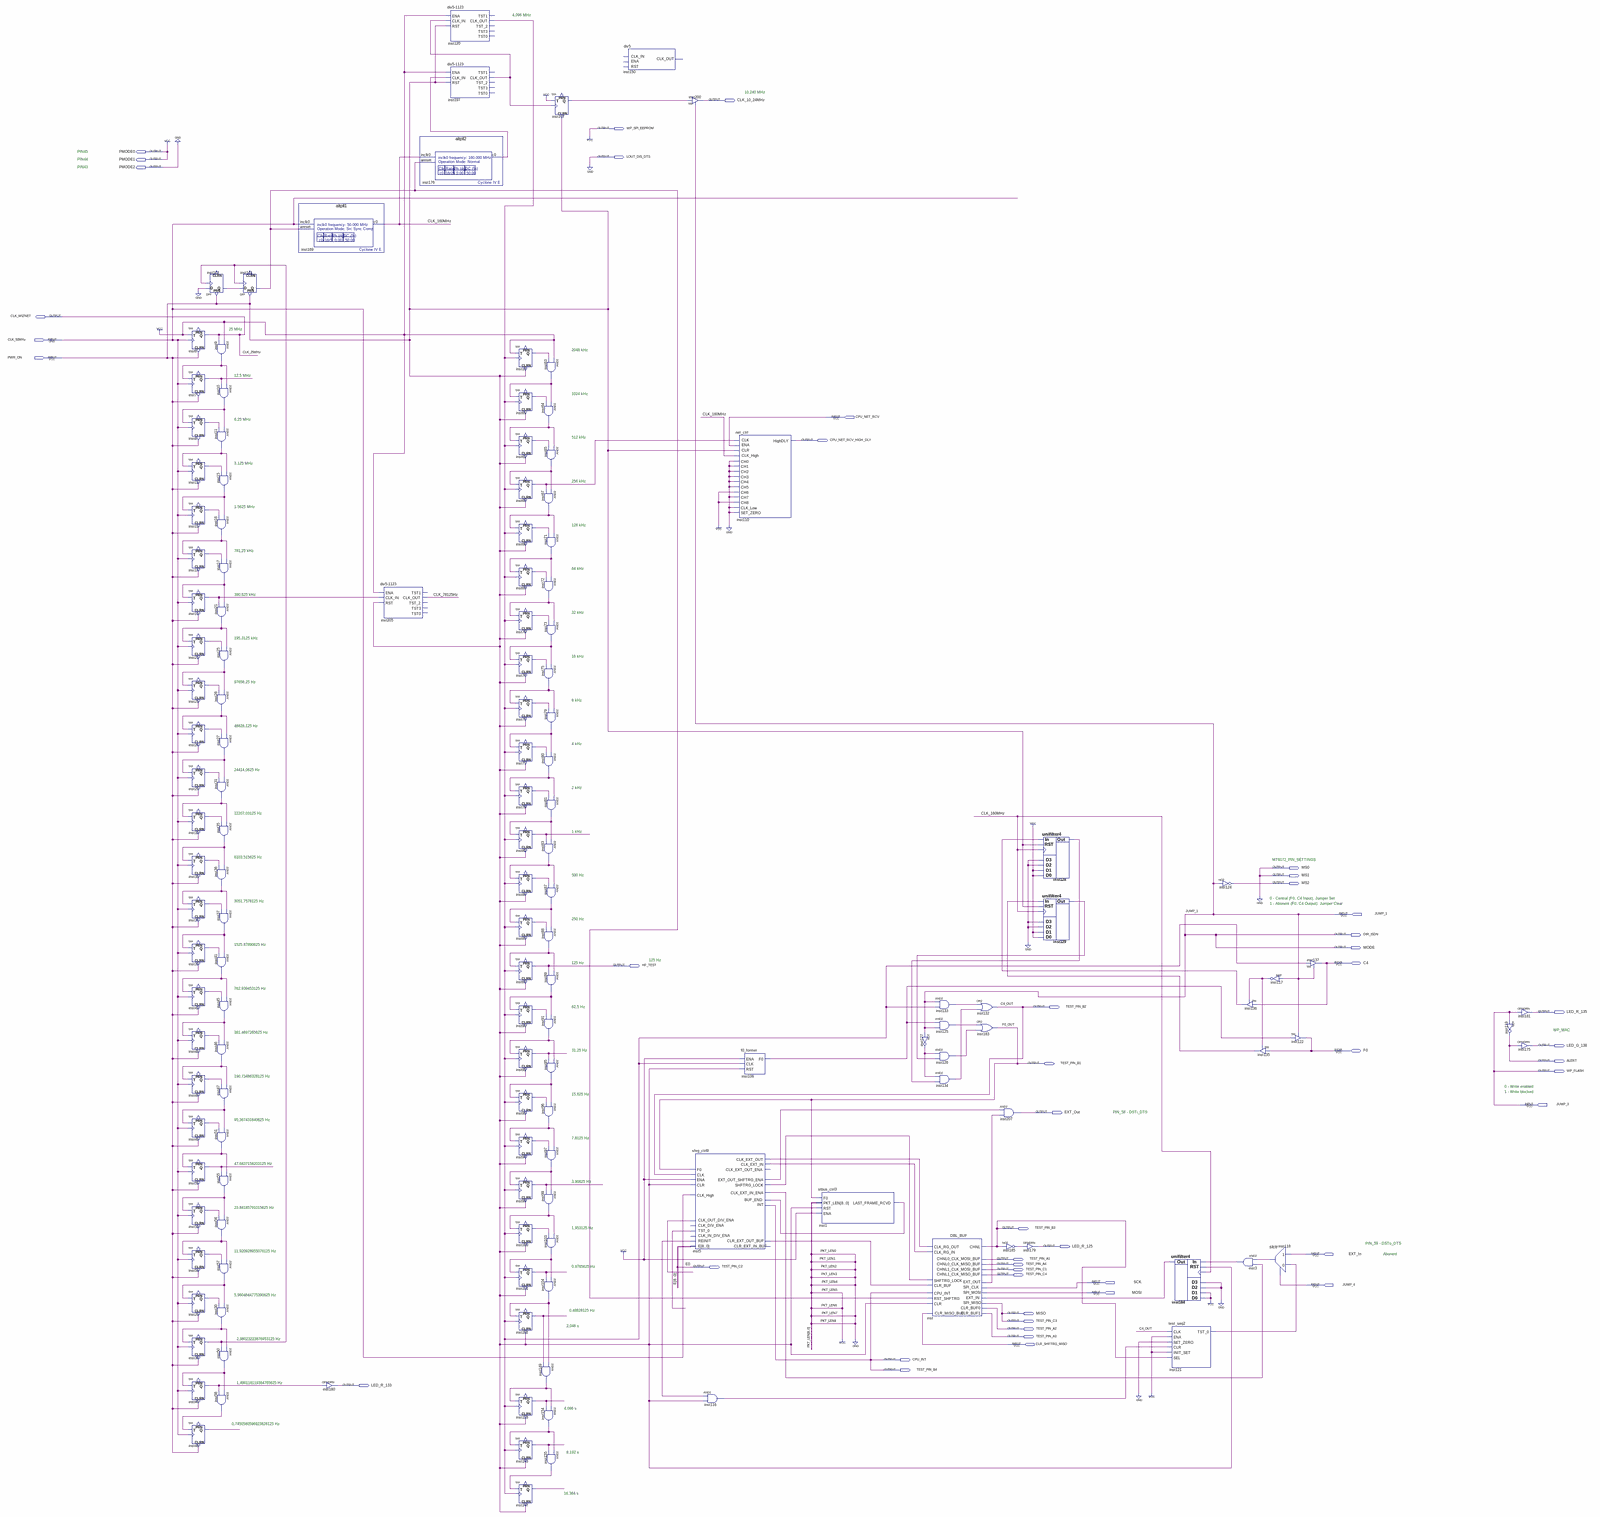
[diagram p0: schematic sheet, whole]
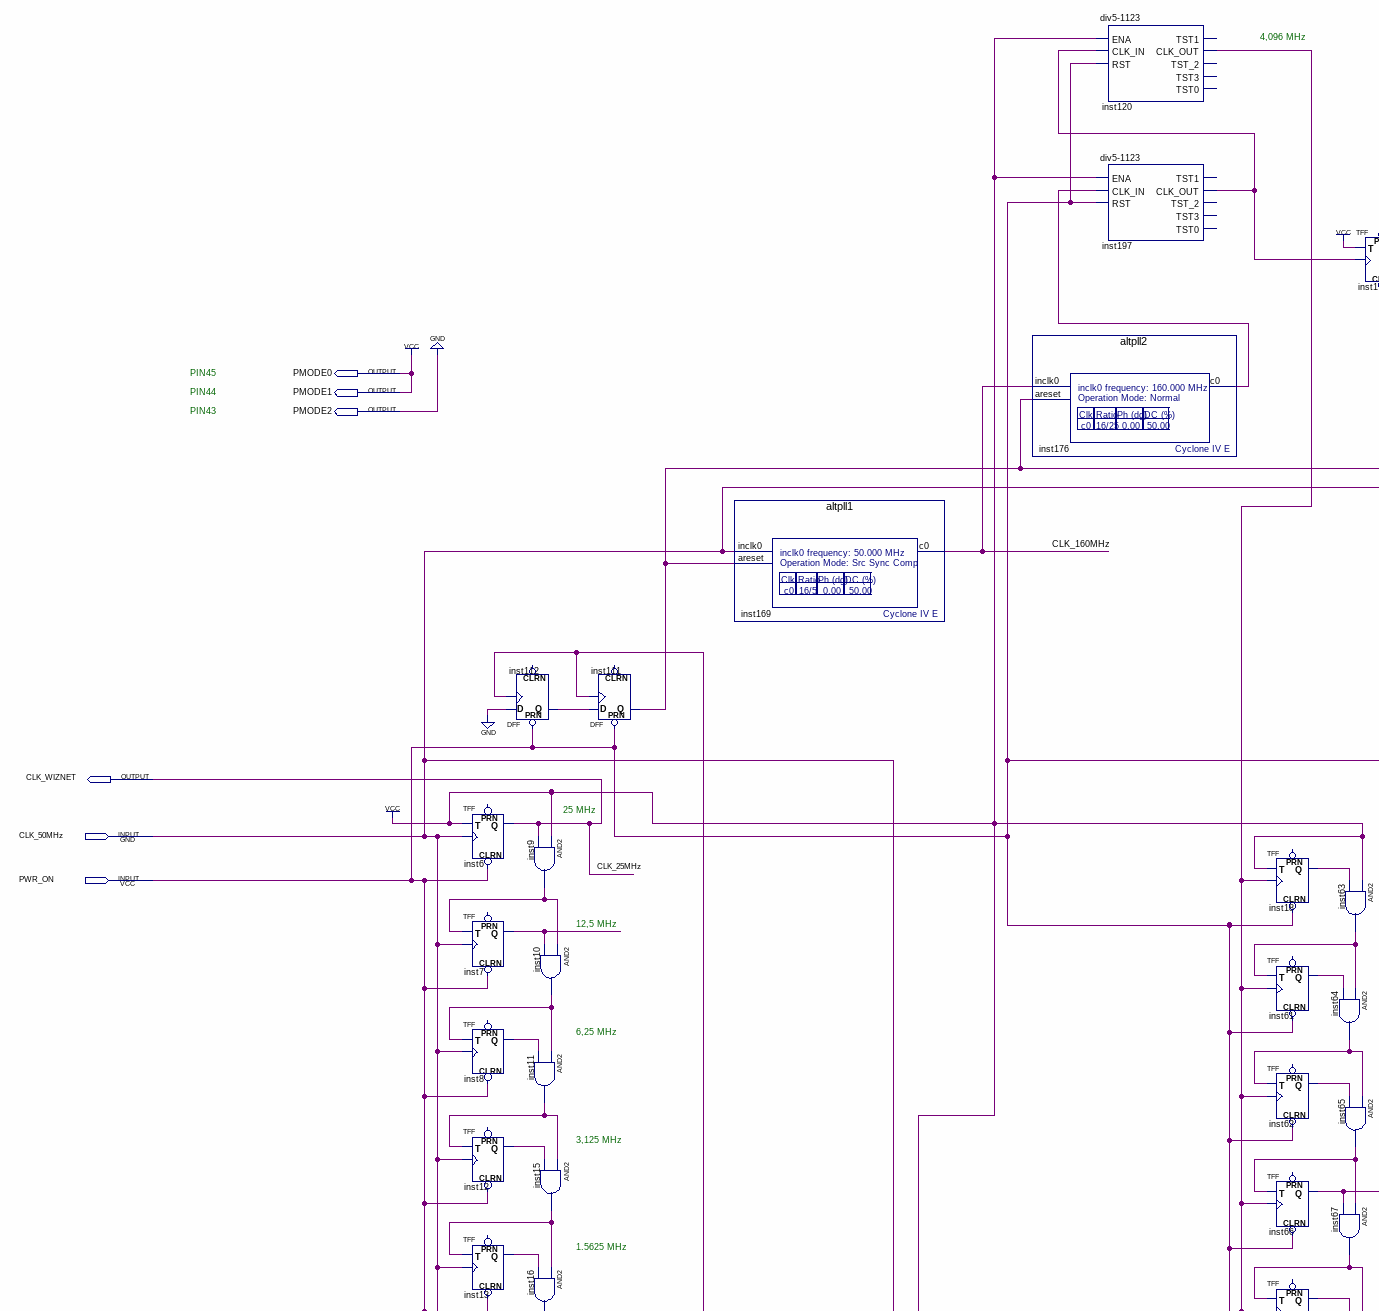
[diagram p1: schematic sheet, upper left part]
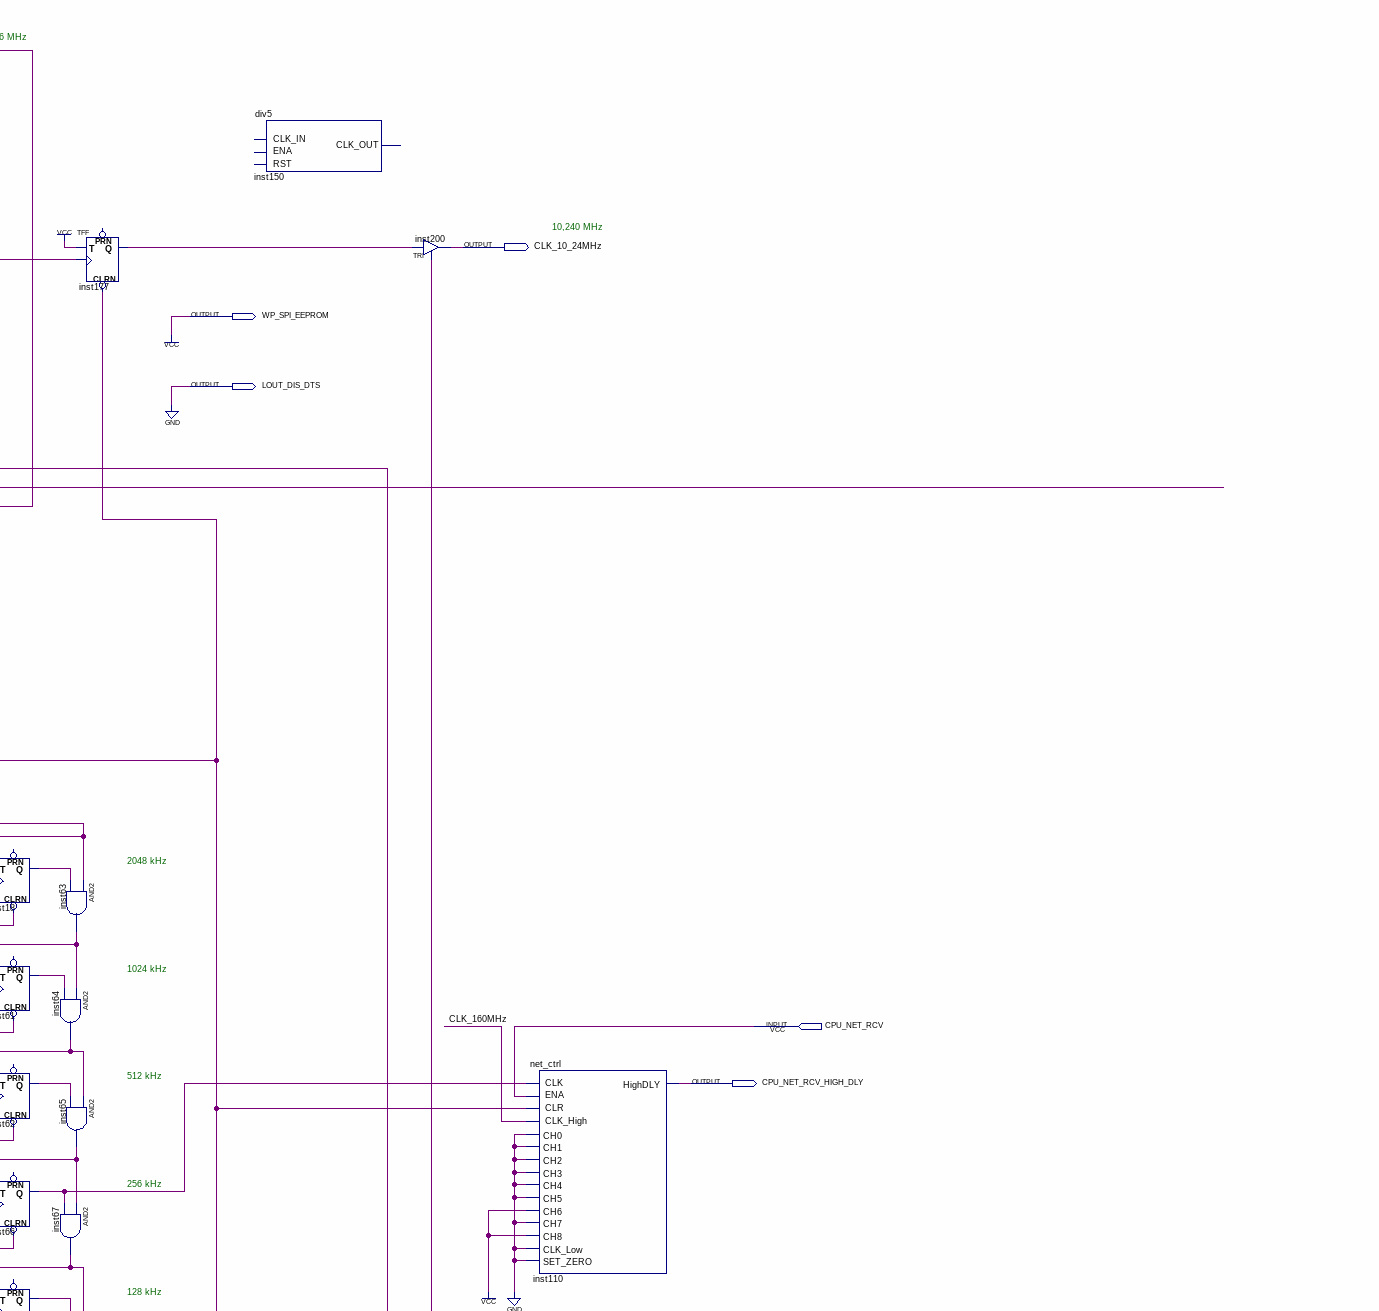
[diagram p2: schematic sheet, upper centre part]
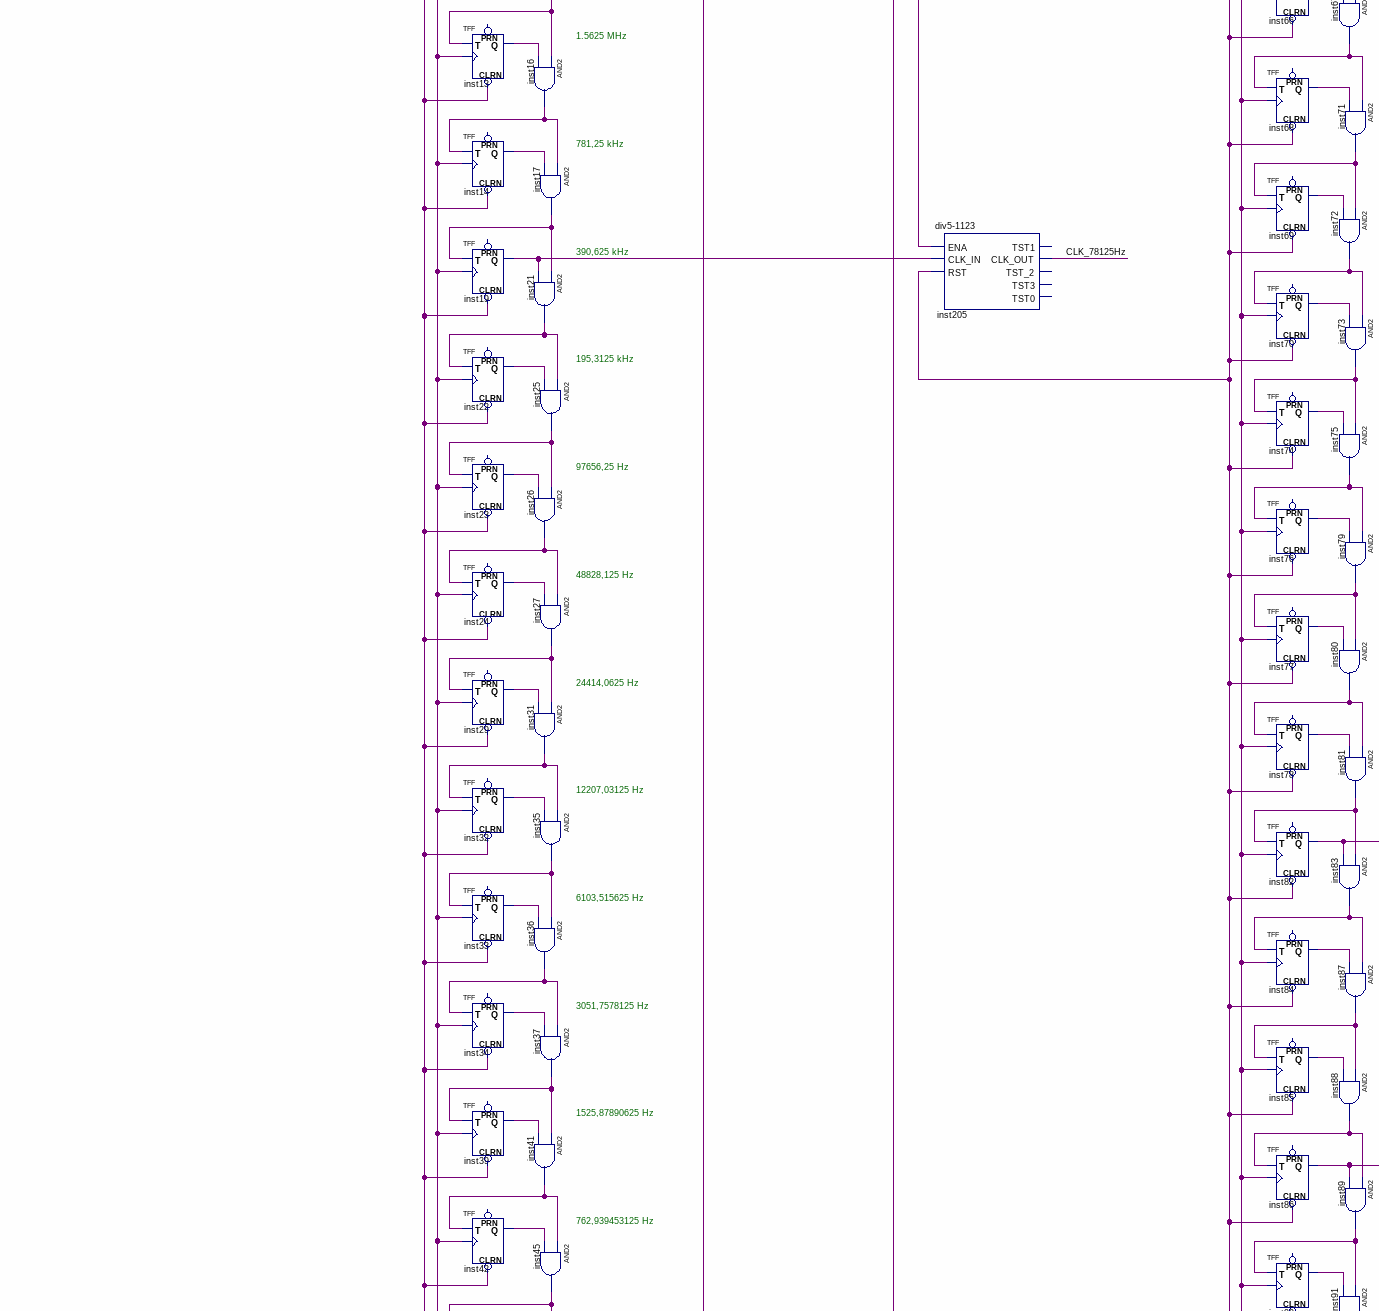
[diagram p3: schematic sheet, middle left part]
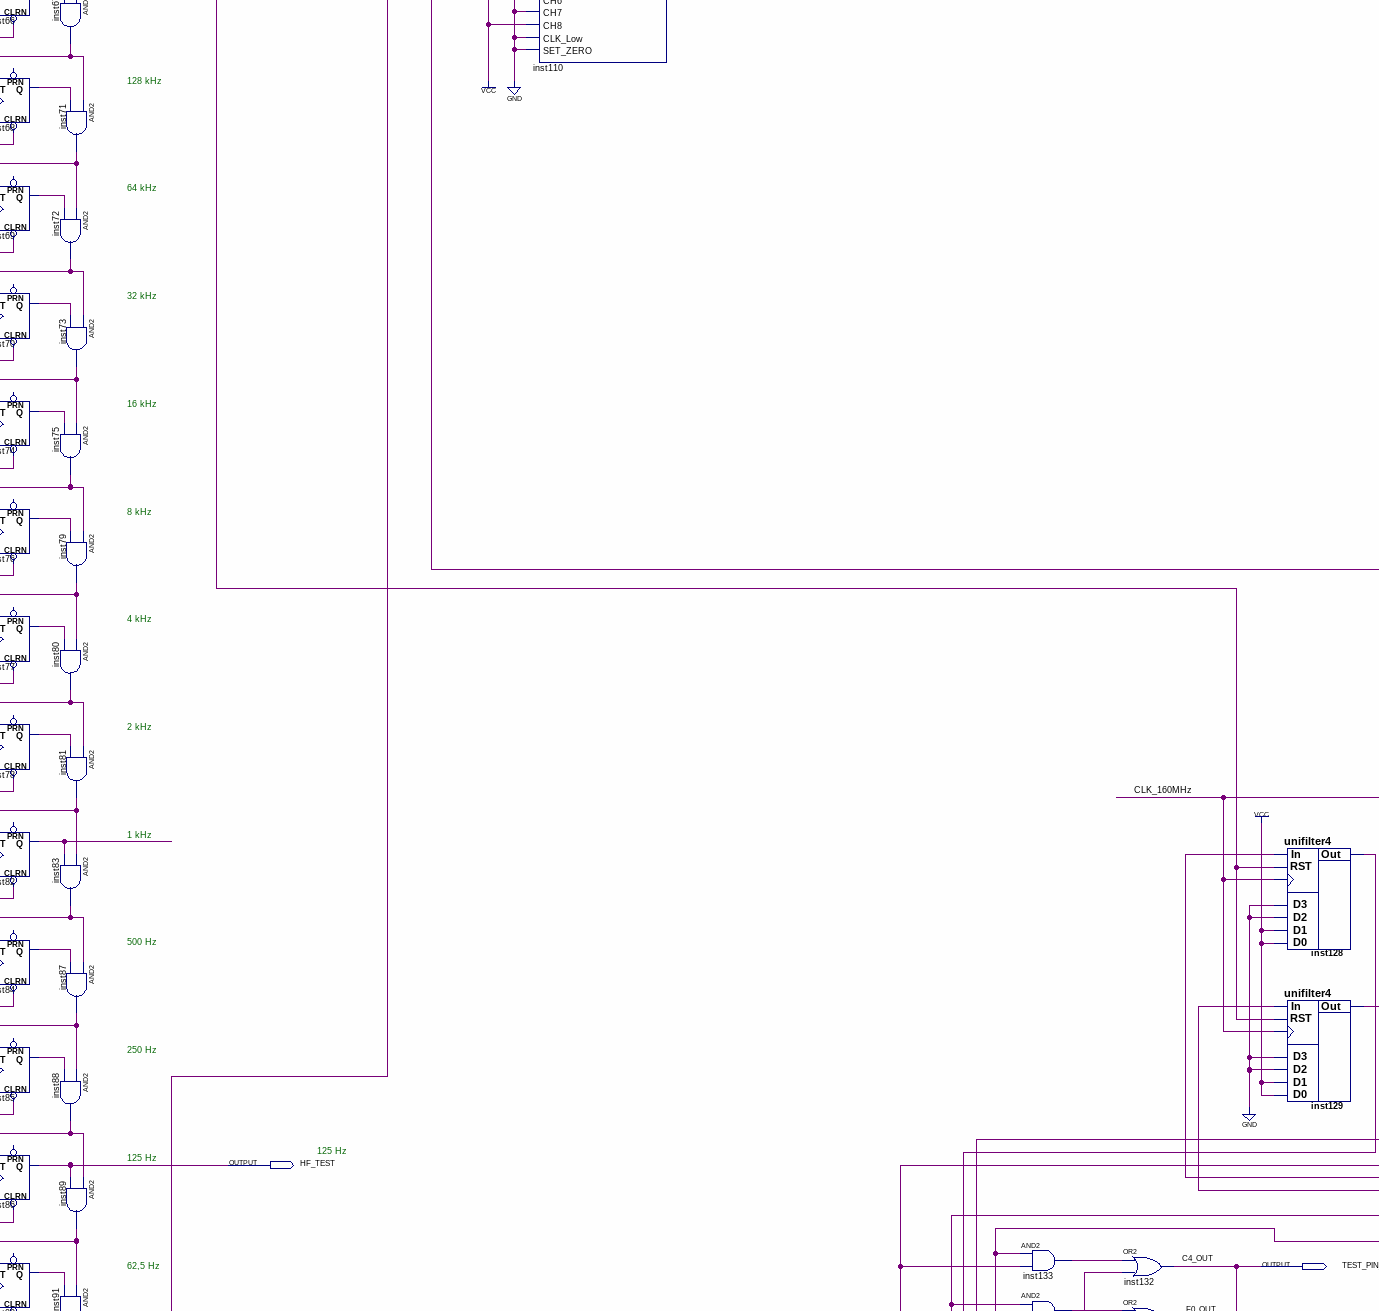
[diagram p4: schematic sheet, middle centre part]
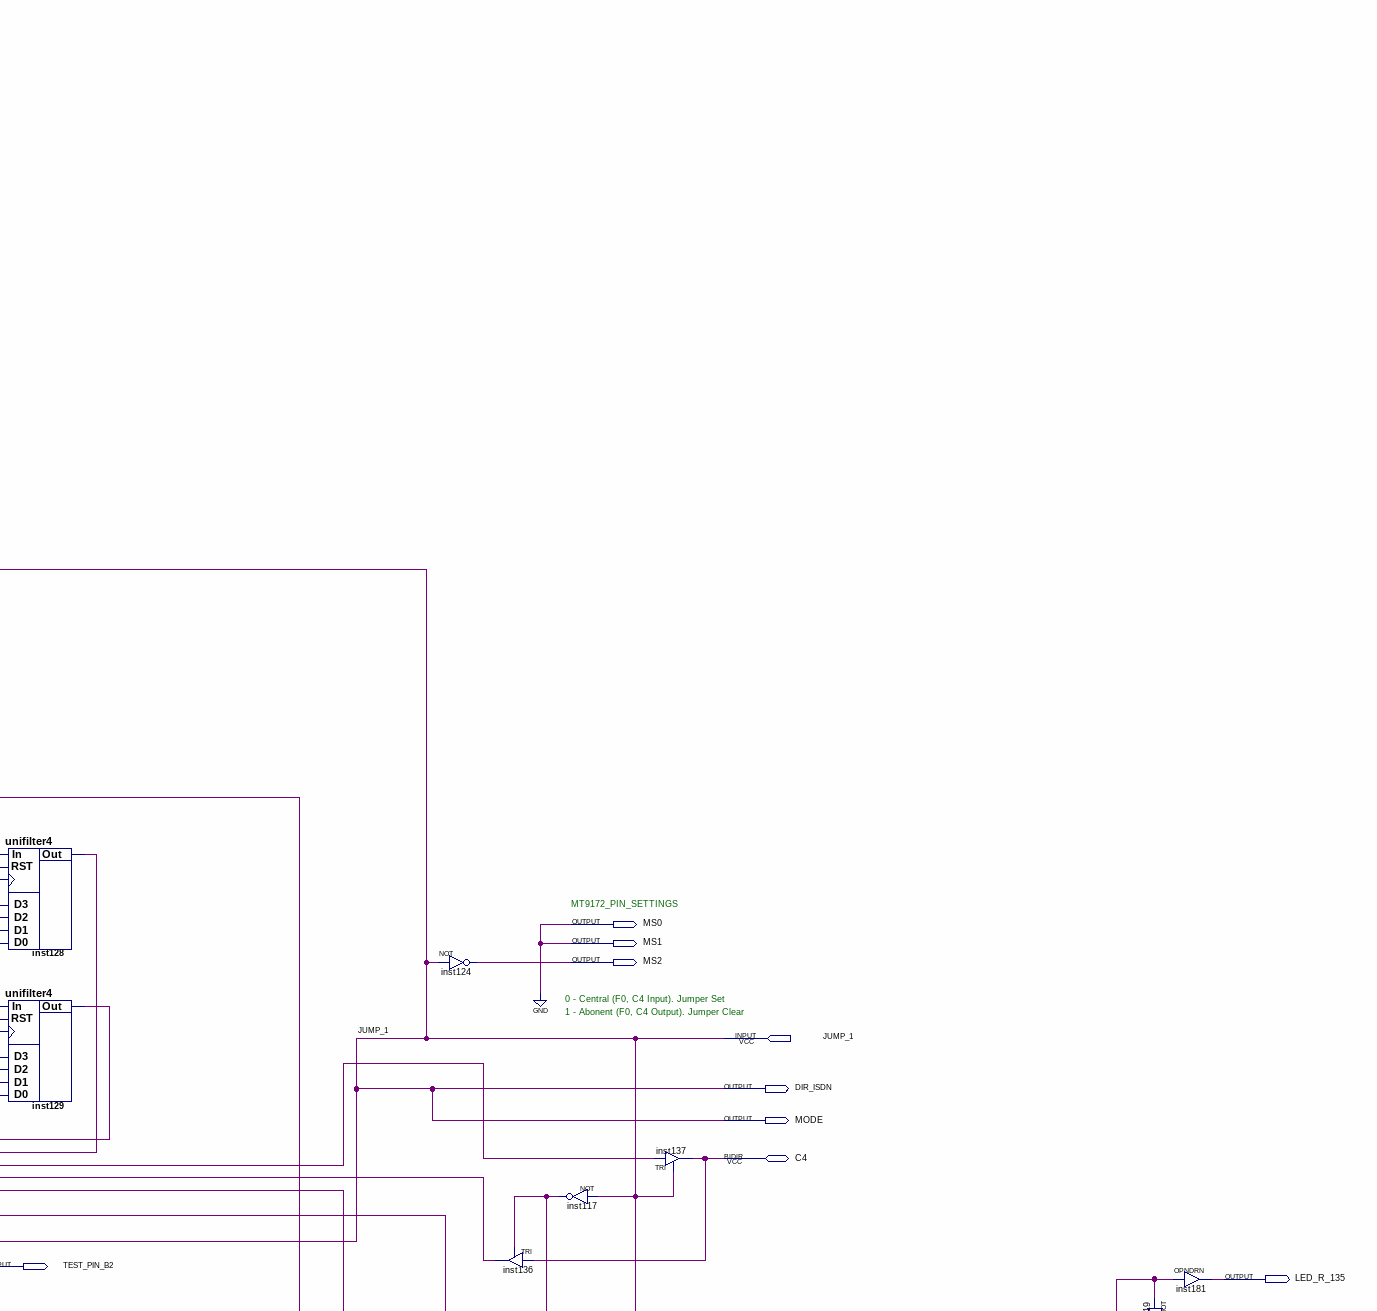
[diagram p5: schematic sheet, middle right part]
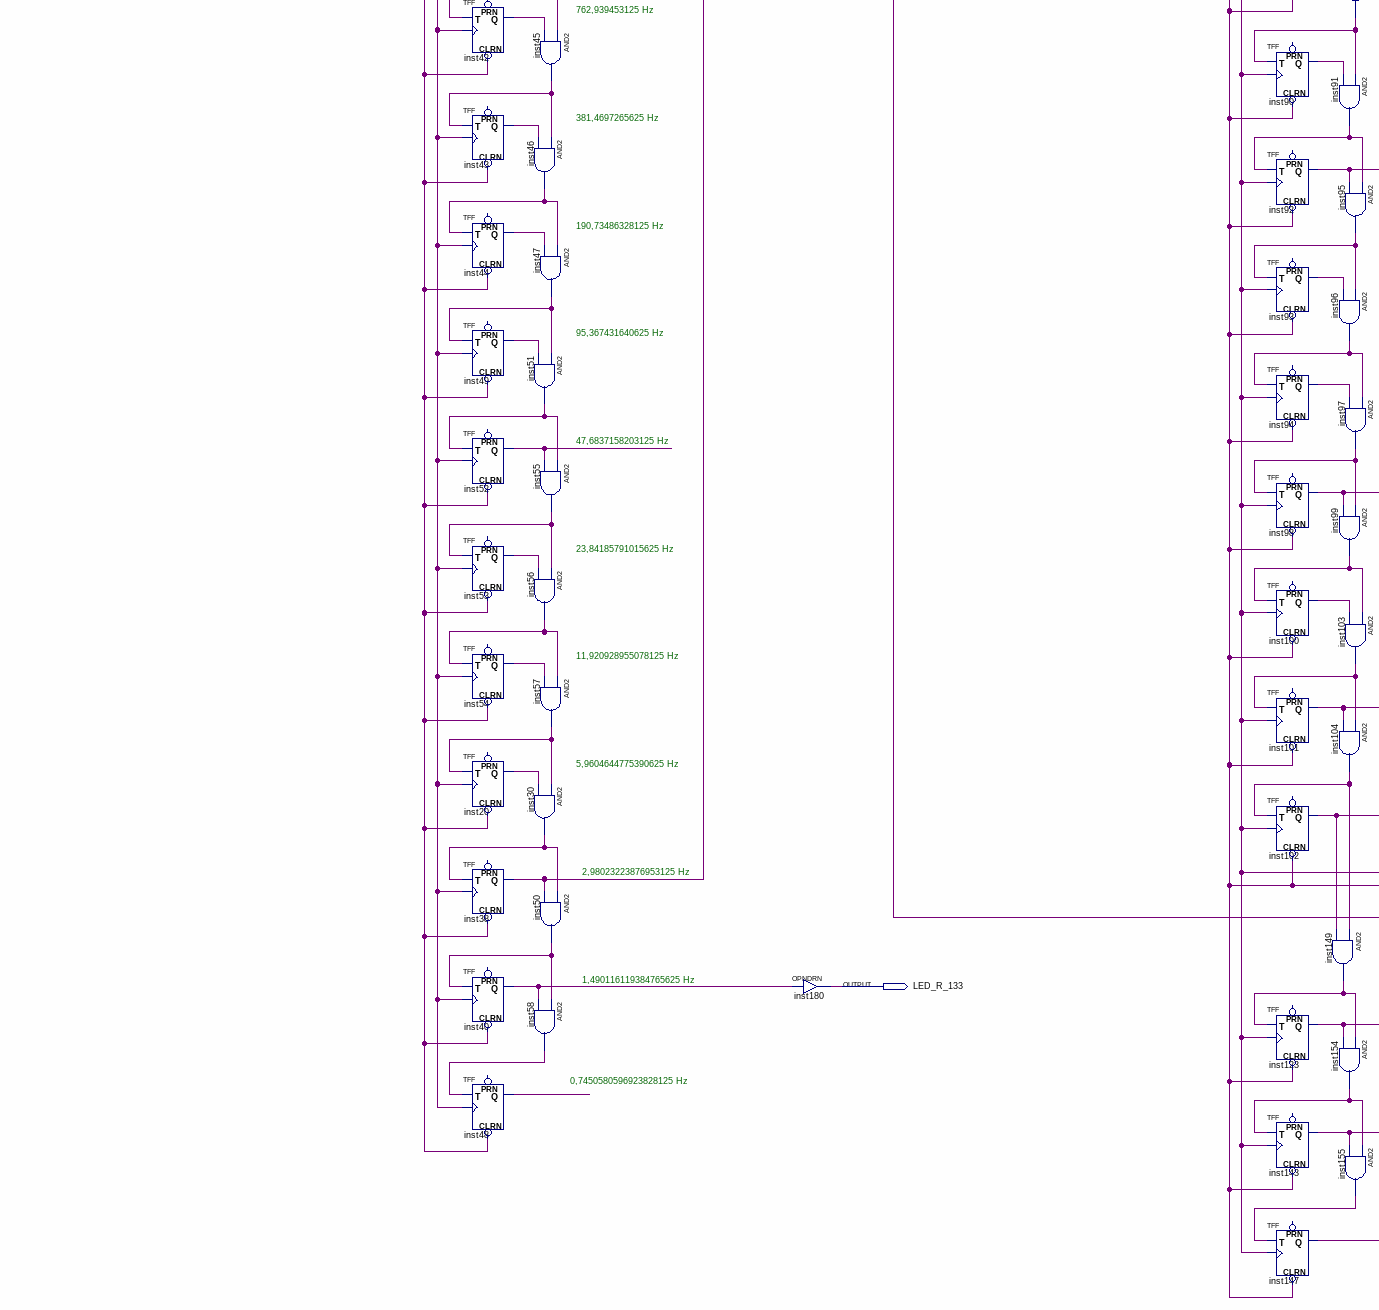
[diagram p6: schematic sheet, lower left part]
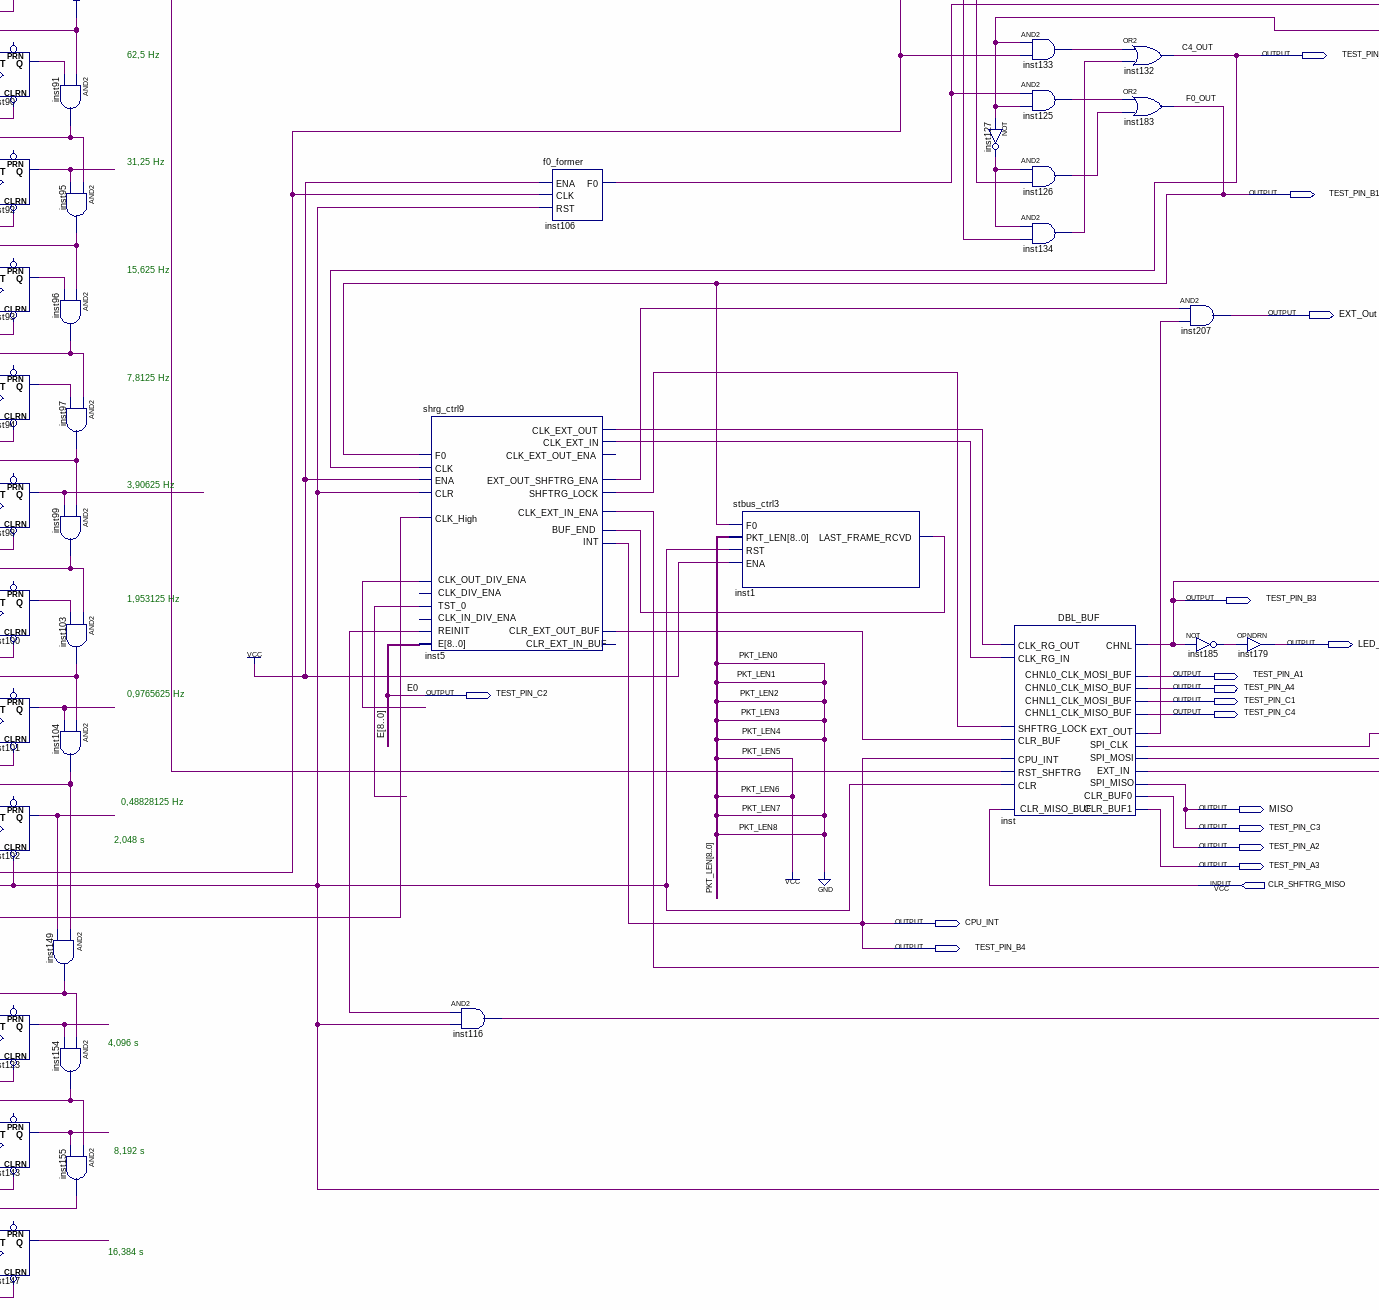
[diagram p7: schematic sheet, lower centre part]
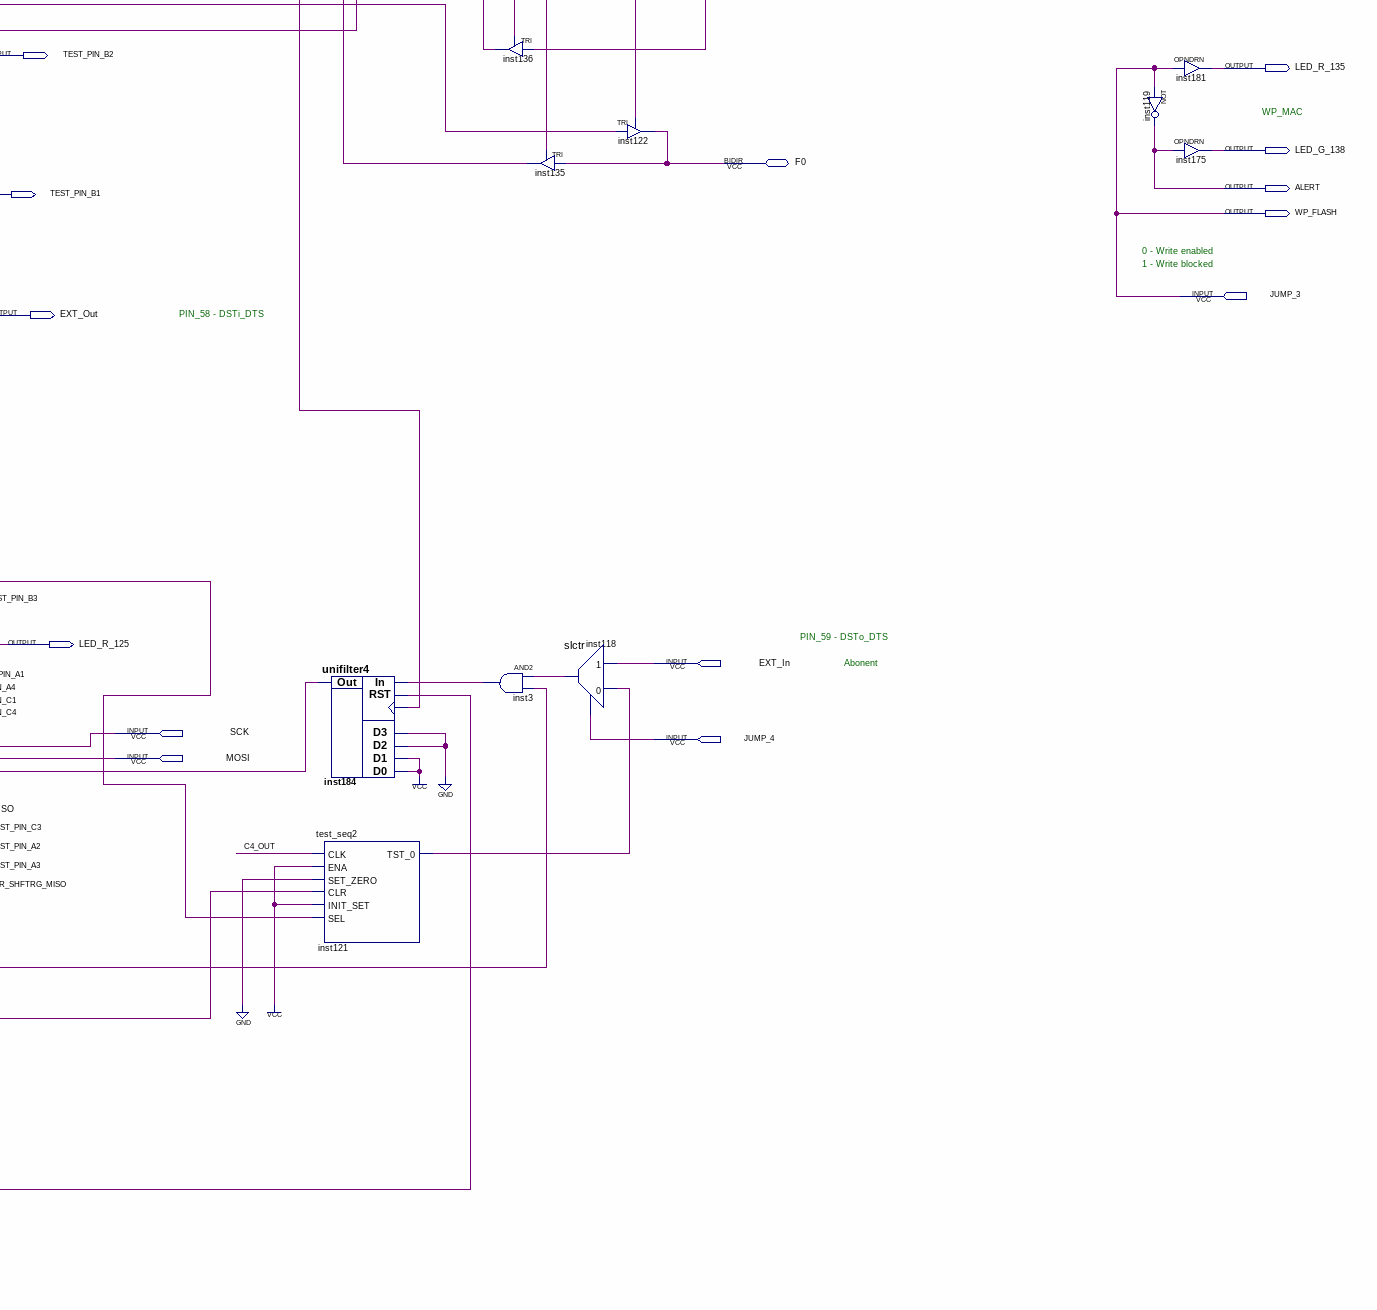
[diagram p8: schematic sheet, lower right part]
// Quartus schematic DCE01_3.bdf as structural Verilog: 144 symbols, 47 pins
module DCE01_3 (
  input  CLK_50MHz,
  input  PWR_ON,
  input  CPU_NET_RCV,
  input  JUMP_1,
  input  JUMP_3,
  input  EXT_In,
  input  SCK,
  input  JUMP_4,
  input  MOSI,
  input  CLR_SHFTRG_MISO,
  inout  C4,
  inout  F0,
  output CLK_10_24MHz,
  output WP_SPI_EEPROM,
  output PMODE0,
  output LOUT_DIS_DTS,
  output PMODE1,
  output PMODE2,
  output CLK_WIZNET,
  output CPU_NET_RCV_HIGH_DLY,
  output MS0,
  output MS1,
  output MS2,
  output DIR_ISDN,
  output MODE,
  output HF_TEST,
  output TEST_PIN_B2,
  output LED_R_135,
  output LED_G_138,
  output ALERT,
  output TEST_PIN_B1,
  output WP_FLASH,
  output EXT_Out,
  output TEST_PIN_B3,
  output LED_R_125,
  output TEST_PIN_A1,
  output TEST_PIN_A4,
  output TEST_PIN_C2,
  output TEST_PIN_C1,
  output TEST_PIN_C4,
  output MISO,
  output TEST_PIN_C3,
  output TEST_PIN_A2,
  output TEST_PIN_A3,
  output CPU_INT,
  output TEST_PIN_B4,
  output LED_R_133
);

  wire CLK_160MHz, CLK_78125Hz, inst1_last_frame_rcvd, inst3_out, inst5_clk_ext_in, inst5_clk_ext_in_ena,
       inst5_clk_ext_out, inst5_clk_out_div_ena, inst5_clr_ext_out_buf, inst5_ext_out_shftrg_ena,
       inst5_reinit, inst5_shftrg_lock, inst5_tst_0, inst7_q, inst8_q, inst9_out, inst10_out, inst11_out,
       inst12_q, inst13_q, inst14_q, inst15_out, inst16_out, inst17_out, inst18_q, inst19_q, inst20_q,
       inst21_out, inst22_q, inst23_q, inst24_q, inst25_out, inst26_out, inst27_out, inst29_q, inst30_out,
       inst31_out, inst32_q, inst33_q, inst34_q, inst35_out, inst36_out, inst37_out, inst38_q, inst39_q,
       inst40_q, inst41_out, inst42_q, inst43_q, inst44_q, inst45_out, inst46_out, inst47_out, inst48_q,
       inst49_q, inst50_out, inst51_out, inst52_q, inst53_q, inst54_q, inst55_out, inst56_out, inst57_out,
       inst58_out, inst61_q, inst62_q, inst63_out, inst64_out, inst65_out, inst66_q, inst67_out, inst68_q,
       inst69_q, inst70_q, inst71_out, inst72_out, inst73_out, inst74_q, inst75_out, inst76_q, inst77_q,
       inst78_q, inst79_out, inst80_out, inst81_out, inst82_q, inst83_out, inst84_q, inst85_q, inst87_out,
       inst88_out, inst89_out, inst90_q, inst91_out, inst92_q, inst93_q, inst94_q, inst95_out, inst96_out,
       inst97_out, inst98_q, inst99_out, inst100_q, inst101_q, inst102_q, inst103_out, inst104_out,
       inst106_f0, inst111_q, inst112_q, inst116_out, inst117_out, inst118_out, inst120_clk_out,
       inst121_tst_0, inst123_q, inst125_out, inst126_out, inst127_out, inst128_out, inst129_out,
       inst133_out, inst134_out, inst135_out, inst136_out, inst143_q, inst147_q, inst149_out, inst154_out,
       inst155_out, inst176_c0, inst177_q, inst184_out, inst185_out, inst197_clk_out, inst_ext_out;
  wire [8:1] E;

  TFF inst6 (.CLRN(PWR_ON), .T(1'b1), .CLK(CLK_50MHz), .Q(CLK_WIZNET));  // open: PRN
  TFF inst7 (.CLRN(PWR_ON), .T(inst9_out), .CLK(CLK_50MHz), .Q(inst7_q));  // open: PRN
  TFF inst8 (.CLRN(PWR_ON), .T(inst10_out), .CLK(CLK_50MHz), .Q(inst8_q));  // open: PRN
  TFF inst12 (.CLRN(PWR_ON), .T(inst11_out), .CLK(CLK_50MHz), .Q(inst12_q));  // open: PRN
  TFF inst13 (.CLRN(PWR_ON), .T(inst15_out), .CLK(CLK_50MHz), .Q(inst13_q));  // open: PRN
  TFF inst14 (.CLRN(PWR_ON), .T(inst16_out), .CLK(CLK_50MHz), .Q(inst14_q));  // open: PRN
  TFF inst19 (.CLRN(PWR_ON), .T(inst17_out), .CLK(CLK_50MHz), .Q(inst19_q));  // open: PRN
  TFF inst22 (.CLRN(PWR_ON), .T(inst21_out), .CLK(CLK_50MHz), .Q(inst22_q));  // open: PRN
  TFF inst23 (.CLRN(PWR_ON), .T(inst25_out), .CLK(CLK_50MHz), .Q(inst23_q));  // open: PRN
  TFF inst24 (.CLRN(PWR_ON), .T(inst26_out), .CLK(CLK_50MHz), .Q(inst24_q));  // open: PRN
  TFF inst29 (.CLRN(PWR_ON), .T(inst27_out), .CLK(CLK_50MHz), .Q(inst29_q));  // open: PRN
  TFF inst32 (.CLRN(PWR_ON), .T(inst31_out), .CLK(CLK_50MHz), .Q(inst32_q));  // open: PRN
  TFF inst33 (.CLRN(PWR_ON), .T(inst35_out), .CLK(CLK_50MHz), .Q(inst33_q));  // open: PRN
  TFF inst34 (.CLRN(PWR_ON), .T(inst36_out), .CLK(CLK_50MHz), .Q(inst34_q));  // open: PRN
  TFF inst39 (.CLRN(PWR_ON), .T(inst37_out), .CLK(CLK_50MHz), .Q(inst39_q));  // open: PRN
  TFF inst42 (.CLRN(PWR_ON), .T(inst41_out), .CLK(CLK_50MHz), .Q(inst42_q));  // open: PRN
  TFF inst43 (.CLRN(PWR_ON), .T(inst45_out), .CLK(CLK_50MHz), .Q(inst43_q));  // open: PRN
  TFF inst44 (.CLRN(PWR_ON), .T(inst46_out), .CLK(CLK_50MHz), .Q(inst44_q));  // open: PRN
  TFF inst49 (.CLRN(PWR_ON), .T(inst47_out), .CLK(CLK_50MHz), .Q(inst49_q));  // open: PRN
  TFF inst52 (.CLRN(PWR_ON), .T(inst51_out), .CLK(CLK_50MHz), .Q(inst52_q));  // open: PRN
  TFF inst53 (.CLRN(PWR_ON), .T(inst55_out), .CLK(CLK_50MHz), .Q(inst53_q));  // open: PRN
  TFF inst54 (.CLRN(PWR_ON), .T(inst56_out), .CLK(CLK_50MHz), .Q(inst54_q));  // open: PRN
  TFF inst20 (.CLRN(PWR_ON), .T(inst57_out), .CLK(CLK_50MHz), .Q(inst20_q));  // open: PRN
  TFF inst38 (.CLRN(PWR_ON), .T(inst30_out), .CLK(CLK_50MHz), .Q(inst38_q));  // open: PRN
  TFF inst40 (.CLRN(PWR_ON), .T(inst50_out), .CLK(CLK_50MHz), .Q(inst40_q));  // open: PRN
  TFF inst48 (.CLRN(PWR_ON), .T(inst58_out), .CLK(CLK_50MHz), .Q(inst48_q));  // open: PRN
  DFF inst112 (.CLK(inst38_q), .D(1'b0), .PRN(PWR_ON), .Q(inst112_q));  // open: CLRN
  and inst9 (inst9_out, 1'b1, CLK_WIZNET);
  and inst10 (inst10_out, inst9_out, inst7_q);
  and inst11 (inst11_out, inst10_out, inst8_q);
  and inst15 (inst15_out, inst11_out, inst12_q);
  and inst16 (inst16_out, inst15_out, inst13_q);
  and inst17 (inst17_out, inst16_out, inst14_q);
  and inst21 (inst21_out, inst17_out, inst19_q);
  and inst25 (inst25_out, inst21_out, inst22_q);
  and inst26 (inst26_out, inst25_out, inst23_q);
  and inst27 (inst27_out, inst26_out, inst24_q);
  and inst31 (inst31_out, inst27_out, inst29_q);
  and inst35 (inst35_out, inst31_out, inst32_q);
  and inst36 (inst36_out, inst35_out, inst33_q);
  and inst37 (inst37_out, inst36_out, inst34_q);
  and inst41 (inst41_out, inst37_out, inst39_q);
  and inst45 (inst45_out, inst41_out, inst42_q);
  and inst46 (inst46_out, inst45_out, inst43_q);
  and inst47 (inst47_out, inst46_out, inst44_q);
  and inst51 (inst51_out, inst47_out, inst49_q);
  and inst55 (inst55_out, inst51_out, inst52_q);
  and inst56 (inst56_out, inst55_out, inst53_q);
  and inst57 (inst57_out, inst56_out, inst54_q);
  and inst30 (inst30_out, inst57_out, inst20_q);
  and inst50 (inst50_out, inst30_out, inst38_q);
  and inst58 (inst58_out, inst50_out, inst40_q);
  DFF inst111 (.CLK(inst38_q), .D(inst112_q), .PRN(PWR_ON), .Q(inst111_q));  // open: CLRN
  altpll1 inst169 (.inclk0(CLK_50MHz), .areset(inst111_q), .c0(CLK_160MHz));
  OPNDRN inst180 (.IN(inst40_q), .OUT(LED_R_133));
  \div5-1123  inst205 (
    .ENA(1'b1), .CLK_IN(inst19_q), .RST(PWR_ON), .CLK_OUT(CLK_78125Hz));  // open: TST1, TST_2, TST3, TST0
  altpll2 inst176 (.inclk0(CLK_160MHz), .areset(inst111_q), .c0(inst176_c0));
  \div5-1123  inst120 (
    .ENA(1'b1), .CLK_IN(inst197_clk_out), .RST(PWR_ON), .CLK_OUT(inst120_clk_out));  // open: TST1, TST_2, TST3, TST0
  \div5-1123  inst197 (
    .ENA(1'b1), .CLK_IN(inst176_c0), .RST(PWR_ON), .CLK_OUT(inst197_clk_out));  // open: TST1, TST_2, TST3, TST0
  TFF inst18 (.CLRN(PWR_ON), .T(1'b1), .CLK(inst120_clk_out), .Q(inst18_q));  // open: PRN
  TFF inst61 (.CLRN(PWR_ON), .T(inst63_out), .CLK(inst120_clk_out), .Q(inst61_q));  // open: PRN
  TFF inst62 (.CLRN(PWR_ON), .T(inst64_out), .CLK(inst120_clk_out), .Q(inst62_q));  // open: PRN
  TFF inst66 (.CLRN(PWR_ON), .T(inst65_out), .CLK(inst120_clk_out), .Q(inst66_q));  // open: PRN
  TFF inst68 (.CLRN(PWR_ON), .T(inst67_out), .CLK(inst120_clk_out), .Q(inst68_q));  // open: PRN
  TFF inst69 (.CLRN(PWR_ON), .T(inst71_out), .CLK(inst120_clk_out), .Q(inst69_q));  // open: PRN
  TFF inst70 (.CLRN(PWR_ON), .T(inst72_out), .CLK(inst120_clk_out), .Q(inst70_q));  // open: PRN
  TFF inst74 (.CLRN(PWR_ON), .T(inst73_out), .CLK(inst120_clk_out), .Q(inst74_q));  // open: PRN
  TFF inst76 (.CLRN(PWR_ON), .T(inst75_out), .CLK(inst120_clk_out), .Q(inst76_q));  // open: PRN
  TFF inst77 (.CLRN(PWR_ON), .T(inst79_out), .CLK(inst120_clk_out), .Q(inst77_q));  // open: PRN
  TFF inst78 (.CLRN(PWR_ON), .T(inst80_out), .CLK(inst120_clk_out), .Q(inst78_q));  // open: PRN
  TFF inst82 (.CLRN(PWR_ON), .T(inst81_out), .CLK(inst120_clk_out), .Q(inst82_q));  // open: PRN
  TFF inst84 (.CLRN(PWR_ON), .T(inst83_out), .CLK(inst120_clk_out), .Q(inst84_q));  // open: PRN
  TFF inst85 (.CLRN(PWR_ON), .T(inst87_out), .CLK(inst120_clk_out), .Q(inst85_q));  // open: PRN
  TFF inst86 (.CLRN(PWR_ON), .T(inst88_out), .CLK(inst120_clk_out), .Q(HF_TEST));  // open: PRN
  TFF inst90 (.CLRN(PWR_ON), .T(inst89_out), .CLK(inst120_clk_out), .Q(inst90_q));  // open: PRN
  TFF inst92 (.CLRN(PWR_ON), .T(inst91_out), .CLK(inst120_clk_out), .Q(inst92_q));  // open: PRN
  TFF inst93 (.CLRN(PWR_ON), .T(inst95_out), .CLK(inst120_clk_out), .Q(inst93_q));  // open: PRN
  TFF inst94 (.CLRN(PWR_ON), .T(inst96_out), .CLK(inst120_clk_out), .Q(inst94_q));  // open: PRN
  TFF inst98 (.CLRN(PWR_ON), .T(inst97_out), .CLK(inst120_clk_out), .Q(inst98_q));  // open: PRN
  TFF inst100 (.CLRN(PWR_ON), .T(inst99_out), .CLK(inst120_clk_out), .Q(inst100_q));  // open: PRN
  TFF inst101 (.CLRN(PWR_ON), .T(inst103_out), .CLK(inst120_clk_out), .Q(inst101_q));  // open: PRN
  TFF inst102 (.CLRN(PWR_ON), .T(inst104_out), .CLK(inst120_clk_out), .Q(inst102_q));  // open: PRN
  TFF inst123 (.CLRN(PWR_ON), .T(inst149_out), .CLK(inst120_clk_out), .Q(inst123_q));  // open: PRN
  TFF inst143 (.CLRN(PWR_ON), .T(inst154_out), .CLK(inst120_clk_out), .Q(inst143_q));  // open: PRN
  TFF inst147 (.CLRN(PWR_ON), .T(inst155_out), .CLK(inst120_clk_out), .Q(inst147_q));  // open: PRN
  and inst149 (inst149_out, inst104_out, inst102_q);
  TFF inst177 (.CLRN(PWR_ON), .T(1'b1), .CLK(inst197_clk_out), .Q(inst177_q));  // open: PRN
  and inst63 (inst63_out, 1'b1, inst18_q);
  and inst64 (inst64_out, inst63_out, inst61_q);
  and inst65 (inst65_out, inst64_out, inst62_q);
  and inst67 (inst67_out, inst65_out, inst66_q);
  and inst71 (inst71_out, inst67_out, inst68_q);
  and inst72 (inst72_out, inst71_out, inst69_q);
  and inst73 (inst73_out, inst72_out, inst70_q);
  and inst75 (inst75_out, inst73_out, inst74_q);
  and inst79 (inst79_out, inst75_out, inst76_q);
  and inst80 (inst80_out, inst79_out, inst77_q);
  and inst81 (inst81_out, inst80_out, inst78_q);
  and inst83 (inst83_out, inst81_out, inst82_q);
  and inst87 (inst87_out, inst83_out, inst84_q);
  and inst88 (inst88_out, inst87_out, inst85_q);
  and inst89 (inst89_out, inst88_out, HF_TEST);
  and inst91 (inst91_out, inst89_out, inst90_q);
  and inst95 (inst95_out, inst91_out, inst92_q);
  and inst96 (inst96_out, inst95_out, inst93_q);
  and inst97 (inst97_out, inst96_out, inst94_q);
  and inst99 (inst99_out, inst97_out, inst98_q);
  and inst103 (inst103_out, inst99_out, inst100_q);
  and inst104 (inst104_out, inst103_out, inst101_q);
  and inst154 (inst154_out, inst149_out, inst123_q);
  and inst155 (inst155_out, inst154_out, inst143_q);
  div5 inst150 ();  // open: CLK_IN, ENA, RST, CLK_OUT
  TRI inst200 (.IN(inst177_q), .OE(JUMP_1), .OUT(CLK_10_24MHz));
  shrg_ctrl9 inst5 (
    .CLK(TEST_PIN_B2), .ENA(1'b1), .F0(TEST_PIN_B1), .BUF_END(inst1_last_frame_rcvd), .CLR(PWR_ON),
    .CLK_High(CLK_50MHz), .E({E, TEST_PIN_C2}), .TST_0(inst5_tst_0), .CLK_OUT_DIV_ENA(inst5_clk_out_div_ena),
    .CLK_EXT_OUT(inst5_clk_ext_out), .EXT_OUT_SHFTRG_ENA(inst5_ext_out_shftrg_ena),
    .CLK_EXT_IN(inst5_clk_ext_in), .CLK_EXT_IN_ENA(inst5_clk_ext_in_ena), .SHFTRG_LOCK(inst5_shftrg_lock),
    .CLR_EXT_OUT_BUF(inst5_clr_ext_out_buf), .REINIT(inst5_reinit), .INT(CPU_INT));  // open: CLK_EXT_OUT_ENA, CLK_DIV_ENA, CLK_IN_DIV_ENA, CLR_EXT_IN_BUF
  and inst116 (inst116_out, inst5_reinit, PWR_ON);
  net_ctrl inst110 (
    .CH0(1'b0), .CH1(1'b0), .CH2(1'b0), .CH3(1'b0), .CH4(1'b0), .CH5(1'b0), .CH6(1'b1), .CH7(1'b0),
    .CH8(1'b1), .CLK(inst66_q), .CLK_High(CLK_160MHz), .CLK_Low(1'b0), .CLR(PWR_ON), .ENA(CPU_NET_RCV),
    .SET_ZERO(1'b0), .HighDLY(CPU_NET_RCV_HIGH_DLY));
  f0_former inst106 (.ENA(1'b1), .CLK(inst120_clk_out), .RST(PWR_ON), .F0(inst106_f0));
  stbus_ctrl3 inst1 (
    .ENA(1'b1), .F0(TEST_PIN_B1), .PKT_LEN(9'b001100000), .RST(PWR_ON),
    .LAST_FRAME_RCVD(inst1_last_frame_rcvd));
  not inst127 (inst127_out, JUMP_1);
  DBL_BUF inst (
    .SPI_CLK(SCK), .CLK_RG_OUT(inst5_clk_ext_out), .CLK_RG_IN(inst5_clk_ext_in), .CPU_INT(CPU_INT),
    .CLR(PWR_ON), .CLR_BUF(inst5_clr_ext_out_buf), .RST_SHFTRG(inst111_q), .SHFTRG_LOCK(inst5_shftrg_lock),
    .SPI_MOSI(MOSI), .EXT_IN(inst184_out), .CLR_MISO_BUF(CLR_SHFTRG_MISO), .CHNL(TEST_PIN_B3),
    .EXT_OUT(inst_ext_out), .SPI_MISO(MISO), .CHNL0_CLK_MOSI_BUF(TEST_PIN_A1),
    .CHNL0_CLK_MISO_BUF(TEST_PIN_A4), .CHNL1_CLK_MOSI_BUF(TEST_PIN_C1), .CHNL1_CLK_MISO_BUF(TEST_PIN_C4),
    .CLR_BUF0(TEST_PIN_A2), .CLR_BUF1(TEST_PIN_A3));
  and inst133 (inst133_out, JUMP_1, inst120_clk_out);
  and inst125 (inst125_out, inst106_f0, JUMP_1);
  and inst126 (inst126_out, inst127_out, inst129_out);
  and inst134 (inst134_out, inst127_out, inst128_out);
  or inst132 (TEST_PIN_B2, inst133_out, inst134_out);
  or inst183 (TEST_PIN_B1, inst125_out, inst126_out);
  and inst207 (EXT_Out, inst5_ext_out_shftrg_ena, inst_ext_out);
  not inst185 (inst185_out, TEST_PIN_B3);
  OPNDRN inst179 (.IN(inst185_out), .OUT(LED_R_125));
  unifilter4 inst128 (
    .RST(PWR_ON), .In(inst136_out), .D3(1'b0), .D2(1'b0), .D1(1'b1), .D0(1'b1), .CLK(CLK_160MHz),
    .Out(inst128_out));
  unifilter4 inst129 (
    .RST(PWR_ON), .In(inst135_out), .D3(1'b0), .D2(1'b0), .D1(1'b1), .D0(1'b1), .CLK(CLK_160MHz),
    .Out(inst129_out));
  unifilter4 inst184 (
    .RST(PWR_ON), .In(inst3_out), .D3(1'b0), .D2(1'b0), .D1(1'b1), .D0(1'b1), .CLK(CLK_160MHz),
    .Out(inst184_out));
  test_seq2 inst121 (
    .CLK(TEST_PIN_B2), .ENA(1'b1), .SET_ZERO(1'b0), .CLR(inst116_out), .INIT_SET(1'b1), .SEL(TEST_PIN_B3),
    .TST_0(inst121_tst_0));
  not inst124 (MS2, JUMP_1);
  and inst3 (inst3_out, inst118_out, inst5_clk_ext_in_ena);
  TRI inst136 (.IN(C4), .OE(inst117_out), .OUT(inst136_out));
  TRI inst135 (.IN(F0), .OE(inst117_out), .OUT(inst135_out));
  not inst117 (inst117_out, JUMP_1);
  slctr inst118 (.SEL(JUMP_4), .In0(inst121_tst_0), .In1(EXT_In), .Out(inst118_out));
  TRI inst122 (.IN(inst106_f0), .OE(JUMP_1), .OUT(F0));
  TRI inst137 (.IN(inst120_clk_out), .OE(JUMP_1), .OUT(C4));
  not inst119 (ALERT, JUMP_3);
  OPNDRN inst181 (.IN(JUMP_3), .OUT(LED_R_135));
  OPNDRN inst175 (.IN(ALERT), .OUT(LED_G_138));

  assign DIR_ISDN = JUMP_1;
  assign LOUT_DIS_DTS = 1'b0;
  assign MODE = JUMP_1;
  assign MS0 = 1'b0;
  assign MS1 = 1'b0;
  assign PMODE0 = 1'b1;
  assign PMODE1 = 1'b1;
  assign PMODE2 = 1'b0;
  assign TEST_PIN_B4 = CPU_INT;
  assign TEST_PIN_C3 = MISO;
  assign WP_FLASH = JUMP_3;
  assign WP_SPI_EEPROM = 1'b1;

  // Other names for the same wires on the sheet: C4_OUT = TEST_PIN_B2; CLK_25MHz = CLK_WIZNET; E[0] = TEST_PIN_C2;
  //   E0 = TEST_PIN_C2; F0_OUT = TEST_PIN_B1

  // Notes on the sheet:
  //   4,096 MHz
  //   10,240 MHz
  //   PIN45
  //   PIN44
  //   PIN43
  //   25 MHz
  //   2048 kHz
  //   12,5 MHz
  //   1024 kHz
  //   6,25 MHz
  //   512 kHz
  //   3,125 MHz
  //   256 kHz
  //   1.5625 MHz
  //   128 kHz
  //   781,25 kHz
  //   64 kHz
  //   390,625 kHz
  //   32 kHz
  //   195,3125 kHz
  //   16 kHz
  //   97656,25 Hz
  //   8 kHz
  //   48828,125 Hz
  //   4 kHz
  //   24414,0625 Hz
  //   2 kHz
  //   12207,03125 Hz
  //   1 kHz
  //   6103,515625 Hz
  //   MT9172_PIN_SETTINGS
  //   500 Hz
  //   0 - Central (F0, C4 Input). Jumper Set
  //   3051,7578125 Hz
  //   1 - Abonent (F0, C4 Output). Jumper Clear
  //   250 Hz
  //   1525,87890625 Hz
  //   125 Hz
  //   125 Hz
  //   762,939453125 Hz
  //   62,5 Hz
  //   WP_MAC
  //   381,4697265625 Hz
  //   31,25 Hz
  //   190,73486328125 Hz
  //   0 - Write enabled
  //   1 - Write blocked
  //   15,625 Hz
  //   PIN_58 - DSTi_DTS
  //   95,367431640625 Hz
  //   7,8125 Hz
  //   47,6837158203125 Hz
  //   3,90625 Hz
  //   23,84185791015625 Hz
  //   1,953125 Hz
  //   PIN_59 - DSTo_DTS
  //   11,920928955078125 Hz
  //   Abonent
  //   0,9765625 Hz
  //   5,9604644775390625 Hz
  //   0,48828125 Hz
  //   2,048 s
  //   2,98023223876953125 Hz
  //   1,490116119384765625 Hz
  //   4,096 s
  //   0,7450580596923828125 Hz
  //   8,192 s
  //   16,384 s
endmodule
